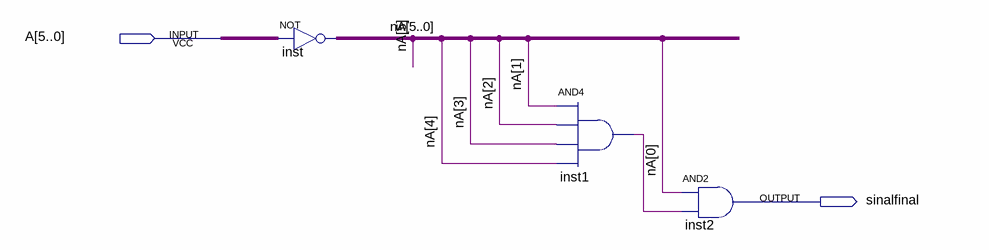
[diagram p0: schematic sheet]
// Quartus schematic sinalmodzero.bdf as structural Verilog: 3 symbols, 2 pins
module sinalmodzero (
  input  [5:0] A,
  output sinalfinal
);

  wire inst1_out;
  wire [5:0] nA;

  assign nA = ~A;  // NOT inst, 6 bits wide
  and inst1 (inst1_out, nA[1], nA[2], nA[3], nA[4]);
  and inst2 (sinalfinal, nA[0], inst1_out);
endmodule
